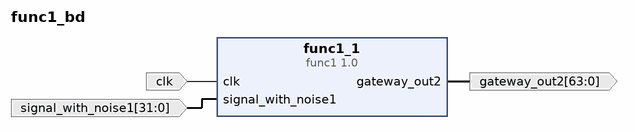
[diagram p0: block diagram of the top level]
# Vivado block design func1_bd, xc7a35tcpg236-1, Vivado 2021.1
create_bd_design func1_bd

create_bd_port -dir I -type clk clk
create_bd_port -dir O -from 63 -to 0 -type data gateway_out2
create_bd_port -dir I -from 31 -to 0 -type data signal_with_noise1

create_bd_cell -type ip -vlnv User_Company:SysGen:func1:1.0 func1_1

# ---- connections ----

connect_bd_net [get_bd_ports clk] [get_bd_pins func1_1/clk]
connect_bd_net [get_bd_pins func1_1/gateway_out2] [get_bd_ports gateway_out2]
connect_bd_net -net signal_with_noise1_1 [get_bd_ports signal_with_noise1] [get_bd_pins func1_1/signal_with_noise1]

validate_bd_design
save_bd_design
